# EAGLE schematic lcd_duffle_pth_mk_6 (EAGLE 6.5.0)
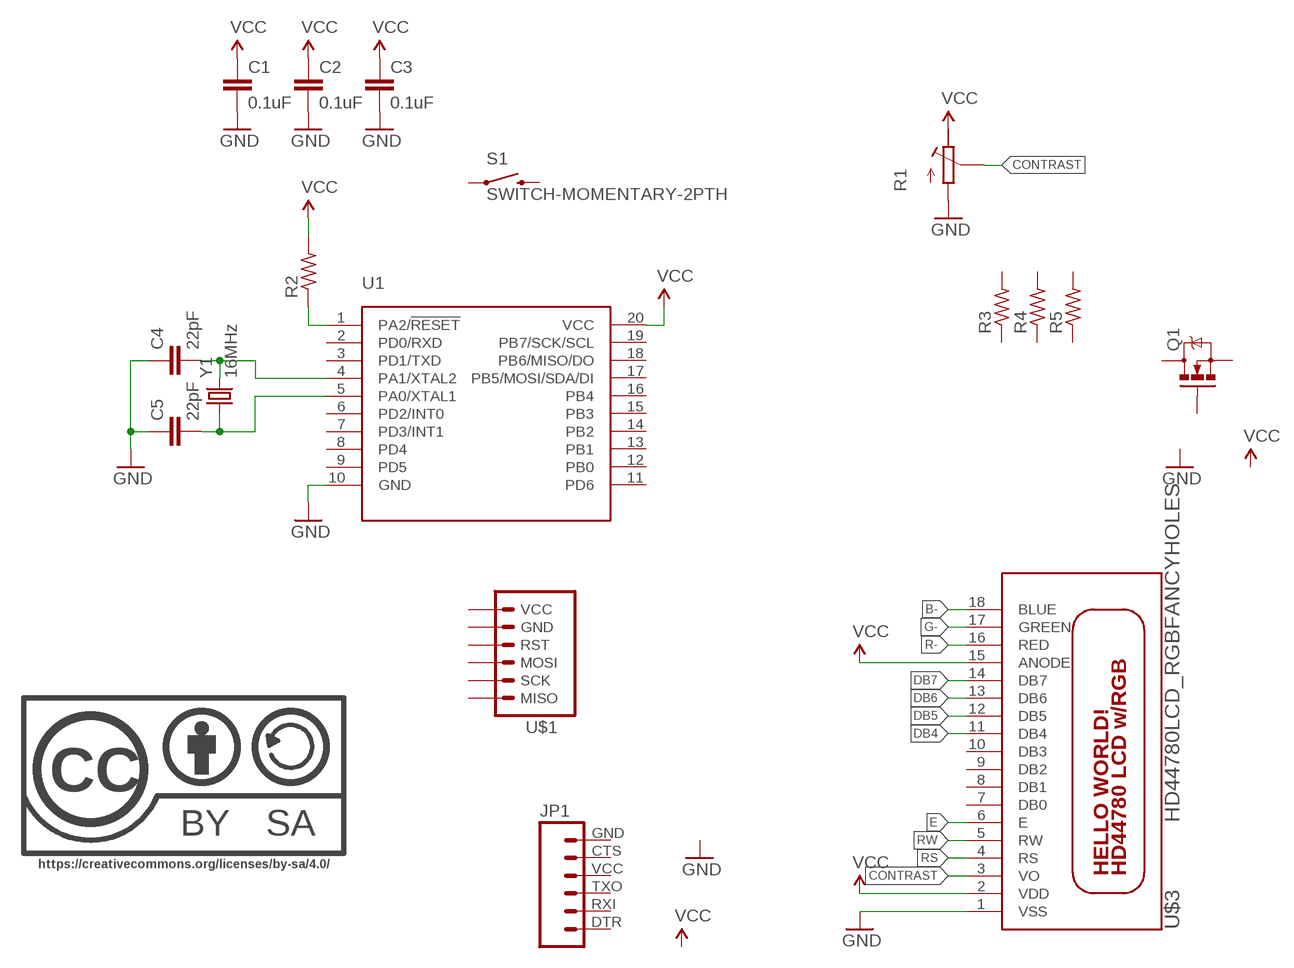
[diagram p0: schematic, sheet 1]

## Parts
C1  0.1uF  CAPACITOR-CERAMIC025-024X044  [C025-024X044]
C2  0.1uF  CAPACITOR-CERAMIC025-024X044  [C025-024X044]
C3  0.1uF  CAPACITOR-CERAMIC025-024X044  [C025-024X044]
C4  22pF  CAPACITOR-CERAMIC025-024X044  [C025-024X044]
C5  22pF  CAPACITOR-CERAMIC025-024X044  [C025-024X044]
JP1  FTDI_BASICPTH-TINY-TEXT  [FTDI_TINY_TXT]
Q1  MOSFET-NCHANNEL2N7000  [TO-92]
R1  POTENTIOMETERTHUMBWHEEL-16MM  [POT-THUMBWHEEL]
R2  RESISTORPTH-AXIAL-6.35MM  [RESISTOR-AXIAL-PTH-6.35MM]
R3  RESISTORPTH-AXIAL-6.35MM  [RESISTOR-AXIAL-PTH-6.35MM]
R4  RESISTORPTH-AXIAL-6.35MM  [RESISTOR-AXIAL-PTH-6.35MM]
R5  RESISTORPTH-AXIAL-6.35MM  [RESISTOR-AXIAL-PTH-6.35MM]
S1  SWITCH-MOMENTARY-2PTH  [TACTILE-PTH]
U1  ATTINY2313ADIP  [DIL20]
U$1  AVR_MINI_PROGJST-XH-RA-PTH  [AVR_MINI_PROG_JST_XH_RA]
U$2  CC-BY-SA-4.0NO-URL  [CC-BY-SA-4.0-NO-URL]
U$3  HD44780LCD_RGBFANCYHOLES  [LCD1602-RGB-CENTERED-MARKEDHOLES]
Y1  16MHz  CRYSTALHC49UV  [HC49U-V]

## Nets
B-: U$3.18(BLUE)
CONTRAST: R1.2(S) R1.2@1(S) U$3.3(VO)
DB4: U$3.11(DB4)
DB5: U$3.12(DB5)
DB6: U$3.13(DB6)
DB7: U$3.14(DB7)
E: U$3.6(E)
G-: U$3.17(GREEN)
GND: C1.2 C2.2 C3.2 C4.1 C5.1 R1.1(A) U1.10(GND) U$3.1(VSS)
N$1: C4.2 U1.4(PA1/XTAL2) Y1.2
N$2: C5.2 U1.5(PA0/XTAL1) Y1.1
N$3: R2.P$1 U1.1(PA2/!RESET)
R-: U$3.16(RED)
RS: U$3.4(RS)
RW: U$3.5(RW)
VCC: C1.1 C2.1 C3.1 R1.3(E) R2.P$2 U1.20(VCC) U$3.2(VDD) U$3.15(ANODE)
Unconnected: JP1.CTS JP1.DTR JP1.GND JP1.RXI JP1.TXO JP1.VCC Q1.1(S) Q1.2(G) Q1.3(D) R3.P$1 R3.P$2 R4.P$1 R4.P$2 R5.P$1 R5.P$2 S1.1 S1.3 U1.2(PD0/RXD) U1.3(PD1/TXD) U1.6(PD2/INT0) U1.7(PD3/INT1) U1.8(PD4) U1.9(PD5) U1.11(PD6) U1.12(PB0) U1.13(PB1) U1.14(PB2) U1.15(PB3) U1.16(PB4) U1.17(PB5/MOSI/SDA/DI) U1.18(PB6/MISO/DO) U1.19(PB7/SCK/SCL) U$1.1(MISO) U$1.2(VCC) U$1.3(SCK) U$1.4(MOSI) U$1.5(RST) U$1.6(GND) U$3.7(DB0) U$3.8(DB1) U$3.9(DB2) U$3.10(DB3)

## Library data of the parts
C1-C5 = A_butts:CAPACITOR-CERAMIC: CAPACITOR, European symbol
JP1 = A_butts:FTDI_BASIC: FTDI Basic header with labels
Q1 = A_butts:MOSFET-NCHANNEL: Common NMOSFET Parts MFG P/N Store ID Prod ID FDD8780 TRANS-09984 SI7820DN TRANS-11055 FDS6630A IC-08089 2N7002PW TRANS-11151 FQP30N06L COM-10213 TRANS-10060 BSS123LT1G TRANS-08345 BSS138 TRANS-00830 BS170 2N7000
R1 = A_butts:POTENTIOMETER: Trimm resistor
R2-R5 = A_butts:RESISTOR: RESISTOR, American symbol
S1 = A_butts:SWITCH-MOMENTARY-2: Various NO switches- pushbuttons, reed, etc
U1 = A_butts:ATTINY2313A: ATTINY2313A 2kB 20MHz I2C/SPI/UART
U$1 = A_butts:AVR_MINI_PROG: AVR ISP 6-pin inline header
U$2 = A_butts:CC-BY-SA-4.0
U$3 = A_butts:HD44780LCD_RGB
Y1 = A_butts:CRYSTAL: Various standard crystals. Proven footprints. Spark Fun Electronics SKU : COM-00534